# Altium project investigator_control_board.PrjPcb
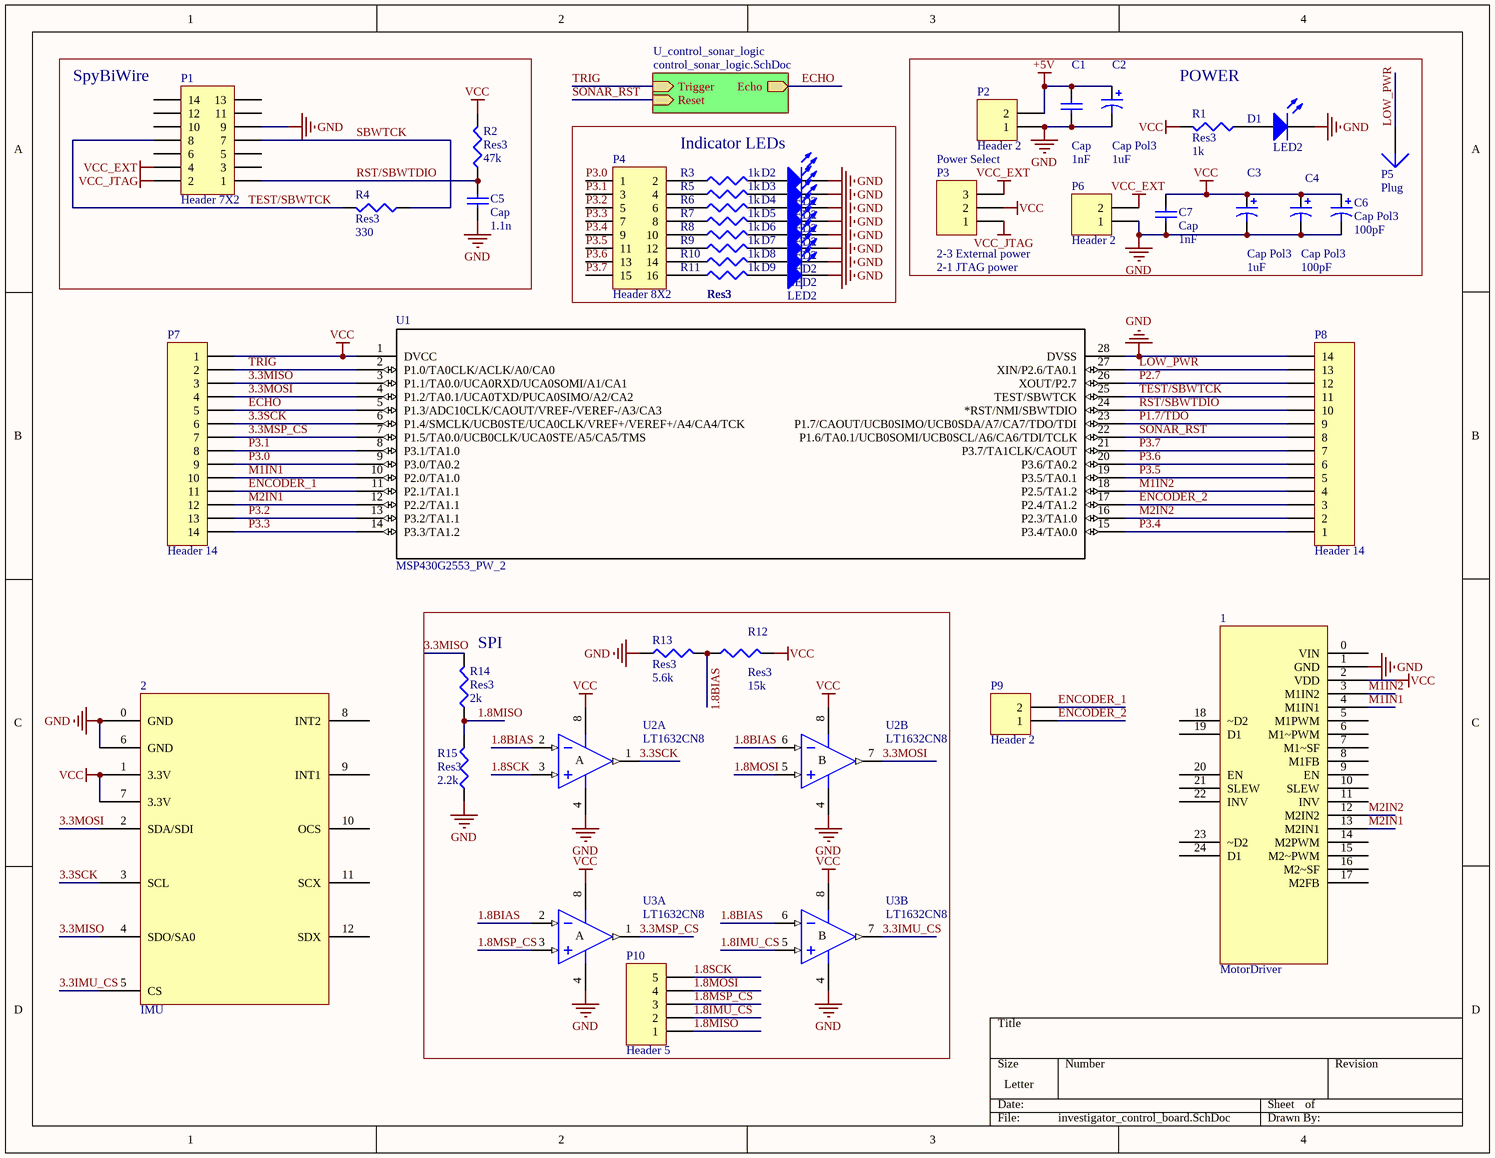
[diagram p0: investigator_control_board.SchDoc]
2 sheets, 54 parts. Net scope: hierarchical (ports join the sheet entries above them; power ports are global).
Board files: investigator_control_board.PcbDoc, control_board_v2.PcbDoc
Sheets:
  investigator_control_board.SchDoc
    U_control_sonar_logic = control_sonar_logic.SchDoc

## Sheet investigator_control_board.SchDoc
size Letter

### Parts
1  MotorDriver  [MotorControlHeader]
2  IMU  [IMU]
C1  Cap  value 1nF  [C0805]
C2  Cap Pol3  value 1uF  [AXIAL-0.3]
C3  Cap Pol3  value 1uF  [AXIAL-0.3]
C4  Cap Pol3  value 100pF  [AXIAL-0.3]
C5  Cap  value 1.1n  [C0805]
C6  Cap Pol3  value 100pF  [AXIAL-0.3]
C7  Cap  value 1nF  [C0805]
D1  LED2  [3.2X1.6X1.1]
D2  LED2  [3.2X1.6X1.1]
D3  LED2  [3.2X1.6X1.1]
D4  LED2  [3.2X1.6X1.1]
D5  LED2  [3.2X1.6X1.1]
D6  LED2  [3.2X1.6X1.1]
D7  LED2  [3.2X1.6X1.1]
D8  LED2  [3.2X1.6X1.1]
D9  LED2  [3.2X1.6X1.1]
P1  Header 7X2  [HDR2X7]
P2  Header 2  [HDR1X2]
P3  Power Select  [HDR1X3]
P4  Header 8X2  [HDR2X8]
P5  Plug  [PIN1]
P6  Header 2  [HDR1X2]
P7  Header 14  [HDR1X14]
P8  Header 14  [HDR1X14]
P9  Header 2  [HDR1X2]
P10  Header 5  [HDR1X5]
R1  Res3  value 1k  [6-0805_M]
R2  Res3  value 47k  [6-0805_M]
R3  Res3  value 1k  [6-0805_N]
R4  Res3  value 330  [6-0805_M]
R5  Res3  value 1k  [6-0805_N]
R6  Res3  value 1k  [6-0805_N]
R7  Res3  value 1k  [6-0805_N]
R8  Res3  value 1k  [6-0805_N]
R9  Res3  value 1k  [6-0805_N]
R10  Res3  value 1k  [6-0805_N]
R11  Res3  value 1k  [6-0805_N]
R12  Res3  value 15k  [6-0805_N]
R13  Res3  value 5.6k  [6-0805_N]
R14  Res3  value 2k  [6-0805_N]
R15  Res3  value 2.2k  [6-0805_N]
U1  MSP430G2553_PW_2  [PW28]
U2  LT1632CN8  [SO08]  (parts A,B of 2)
U3  LT1632CN8  [SO08]  (parts A,B of 2)

### Blocks framed on the sheet
SpyBiWire: C5 P1 R2 R4
POWER: C1-C4 C6 C7 D1 P2 P3 P5 P6 R1
Indicator LEDs: D2-D9 P4 R3 R5-R11
SPI: P10 R12-R15 U2 U3

### Sub-sheets
U_control_sonar_logic = control_sonar_logic.SchDoc: Trigger (in), Reset (in), Echo (out)

### Nets
+5V: C1.2 C2.1 P2.2
GND: 1.1(GND) 2.0(GND) 2.6(GND) C1.1 C2.2 C3.2 C4.2 C5.1 C6.2 C7.1 D1.2(K) D2.2(K) D3.2(K) D4.2(K) D5.2(K) D6.2(K) D7.2(K) D8.2(K) D9.2(K) P1.9 P2.1 P6.1 P8.14 R13.1 R15.1 U1.28(DVSS) U2.4(V-) U3.4(V-)
VCC: 1.2(VDD) 2.1(3.3V) 2.7(3.3V) C3.1 C4.1 C6.1 C7.2 P3.2 P7.1 R1.2 R2.2 R12.2 U1.1(DVCC) U2.8(V+) U3.8(V+)
VCC_EXT: P1.4 P3.3 P6.2
VCC_JTAG: P1.2 P3.1
1.8BIAS: R12.1 R13.2 U2.2(IN-) U2.6(IN-) U3.2(IN-) U3.6(IN-)
1.8IMU_CS: P10.2 U3.5(IN+)
1.8MISO: P10.1 R14.1 R15.2
1.8MOSI: P10.4 U2.5(IN+)
1.8MSP_CS: P10.3 U3.3(IN+)
1.8SCK: P10.5 U2.3(IN+)
3.3IMU_CS: 2.5(CS) U3.7(OUT)
3.3MISO: 2.4(SDO/SA0) P7.3 R14.2 U1.3(P1.1/TA0.0/UCA0RXD/UCA0SOMI/A1/CA1)
3.3MOSI: 2.2(SDA/SDI) P7.4 U1.4(P1.2/TA0.1/UCA0TXD/PUCA0SIMO/A2/CA2) U2.7(OUT)
3.3MSP_CS: P7.7 U1.7(P1.5/TA0.0/UCB0CLK/UCA0STE/A5/CA5/TMS) U3.1(OUT)
3.3SCK: 2.3(SCL) P7.6 U1.6(P1.4/SMCLK/UCB0STE/UCA0CLK/VREF+/VEREF+/A4/CA4/TCK) U2.1(OUT)
ECHO: P7.5 U1.5(P1.3/ADC10CLK/CAOUT/VREF-/VEREF-/A3/CA3) ; sheet U_control_sonar_logic/Echo
ENCODER_1: P7.11 P9.2 U1.11(P2.1/TA1.1)
ENCODER_2: P8.3 P9.1 U1.17(P2.4/TA1.2)
LOW_PWR: P5.1 P8.13 U1.27(XIN/P2.6/TA0.1)
M1IN1: 1.4(M1IN1) P7.10 U1.10(P2.0/TA1.0)
M1IN2: 1.3(M1IN2) P8.4 U1.18(P2.5/TA1.2)
M2IN1: 1.13(M2IN1) P7.12 U1.12(P2.2/TA1.1)
M2IN2: 1.12(M2IN2) P8.2 U1.16(P2.3/TA1.0)
P1.7/TDO: P8.9 U1.23(P1.7/CAOUT/UCB0SIMO/UCB0SDA/A7/CA7/TDO/TDI)
P2.7: P8.12 U1.26(XOUT/P2.7)
P3.0: P4.1 P7.9 U1.9(P3.0/TA0.2)
P3.1: P4.3 P7.8 U1.8(P3.1/TA1.0)
P3.2: P4.5 P7.13 U1.13(P3.2/TA1.1)
P3.3: P4.7 P7.14 U1.14(P3.3/TA1.2)
P3.4: P4.9 P8.1 U1.15(P3.4/TA0.0)
P3.5: P4.11 P8.5 U1.19(P3.5/TA0.1)
P3.6: P4.13 P8.6 U1.20(P3.6/TA0.2)
P3.7: P4.15 P8.7 U1.21(P3.7/TA1CLK/CAOUT)
RST/SBWTDIO: C5.2 P1.1 P8.10 R2.1 U1.24(*RST/NMI/SBWTDIO)
SBWTCK: P1.7 R4.1
SONAR_RST: P8.8 U1.22(P1.6/TA0.1/UCB0SOMI/UCB0SCL/A6/CA6/TDI/TCLK) ; sheet U_control_sonar_logic/Reset
TEST/SBWTCK: P1.8 P8.11 R4.2 U1.25(TEST/SBWTCK)
TRIG: P7.2 U1.2(P1.0/TA0CLK/ACLK/A0/CA0) ; sheet U_control_sonar_logic/Trigger
NetD1_1: D1.1(A) R1.1
NetD2_1: D2.1(A) R3.2
NetD3_1: D3.1(A) R5.2
NetD4_1: D4.1(A) R6.2
NetD5_1: D5.1(A) R7.2
NetD6_1: D6.1(A) R8.2
NetD7_1: D7.1(A) R9.2
NetD8_1: D8.1(A) R10.2
NetD9_1: D9.1(A) R11.2
NetP4_2: P4.2 R3.1
NetP4_4: P4.4 R5.1
NetP4_6: P4.6 R6.1
NetP4_8: P4.8 R7.1
NetP4_10: P4.10 R8.1
NetP4_12: P4.12 R9.1
NetP4_14: P4.14 R10.1
NetP4_16: P4.16 R11.1

Not connected (* = marked no-connect by the designer): 1 0(VIN) 5(M1PWM) 6(M1~PWM) 7(M1~SF) 8(M1FB) 9(EN) 10(SLEW) 11(INV) 14(M2PWM) 15(M2~PWM) 16(M2~SF) 17(M2FB) 18(~D2) 19(D1) 20(EN) 21(SLEW) 22(INV) 23(~D2) 24(D1); 2 8(INT2) 9(INT1) 10(OCS) 11(SCX) 12(SDX); P1 3 5 6 10 11 12 13 14

### Notes on the sheet
- (near P3) 2-3 External power
- (near P3) 2-1 JTAG power
- (in symbol LT1632CN8, part A) A
- (in symbol LT1632CN8, part B) B

### Library data of the parts
C1 C5 C7 = Cap: Capacitor; Published: 8-Jun-2000; LatestRevisionDate: 17-Jul-2002; LatestRevisionNote: Re-released for DXP Platform.; PackageReference: RAD-0.3; Publisher: Altium Limited; PackageDescription: Radial Cap, Thru-Hole; 2 Leads; 0.3 in Pin Spacing
C2-C4 C6 = Cap Pol3: Polarized Capacitor (Surface Mount); Published: 8-Jun-2000; LatestRevisionDate: 29-May-2009; LatestRevisionNote: IPC-7351 Footprint Added.; PackageReference: C0805; Publisher: Altium Limited; PackageDescription: Chip Capacitor
D1-D9 = LED2: Typical RED, GREEN, YELLOW, AMBER GaAs LED; Published: 8-Jun-2000; LatestRevisionDate: 17-Jul-2002; LatestRevisionNote: Re-released for DXP Platform.; PackageVersion: Feb-2002; PackageReference: 3.2X1.6X1.1; Publisher: Altium Limited; PackageDescription: SM LED; 2 Flat Leads
P1 = Header 7X2: Header, 7-Pin, Dual row; LatestRevisionDate: 17-Jul-2002; LatestRevisionNote: Re-released for DXP Platform.; Publisher: Altium Limited
P2 P6 P9 = Header 2: Header, 2-Pin; LatestRevisionDate: 17-Jul-2002; LatestRevisionNote: Re-released for DXP Platform.; Publisher: Altium Limited
P3 = Header 3: Header, 3-Pin; LatestRevisionDate: 17-Jul-2002; LatestRevisionNote: Re-released for DXP Platform.; Publisher: Altium Limited
P4 = Header 8X2: Header, 8-Pin, Dual row; LatestRevisionDate: 17-Jul-2002; LatestRevisionNote: Re-released for DXP Platform.; Publisher: Altium Limited
P7 P8 = Header 14: Header, 14-Pin; LatestRevisionDate: 17-Jul-2002; LatestRevisionNote: Re-released for DXP Platform.; Publisher: Altium Limited
P10 = Header 5: Header, 5-Pin; LatestRevisionDate: 17-Jul-2002; LatestRevisionNote: Re-released for DXP Platform.; Publisher: Altium Limited
R1-R15 = Res3: Resistor; Published: 8-Jun-2000; LatestRevisionDate: 29-May-2009; LatestRevisionNote: IPC-7351 Footprint Added.; PackageReference: J1-0603; Publisher: Altium Limited; PackageDescription: Chip Resistor
U1 = MSP430G2553_PW_2: Imported; Manufacturer_Part_Number: msp430g2553_pw_28; Vendor: Texas Instruments; PACKAGE_DESIGNATOR: PW; PIN_COUNT: 28; FAMILY_NAME: Value Line; INDUSTRY_STD_PKG_TYPE: TSSOP; GENERIC_PART_NUMBER: MSP430G2553; Datasheet URL: http://www.ti.com/lit/gpn/MSP430G2553; Manufacturer: Texas Instruments; RefDes: RefDes; Type: DEV; Value: Value
U2 U3 = LT1632CN8: 45MHz, 45V/µs, Dual Rail-to-Rail Input and Output Precision Operational Amplifier; Note: 1455; Published: 8-Jun-2000; LatestRevisionDate: 29-May-2009; LatestRevisionNote: Component Body Added.; DatasheetVersion: 1996; PackageVersion: N8 1002; PackageReference: N8; Publisher: Altium Limited; PackageDescription: DIP, Plastic, 8-Pin, Row Spacing 7.62 mm, Pitch 2.54 mm; ComponentLink1Description: Manufacturer Link; ComponentLink1URL: http://www.linear.com/; ComponentLink2Description: Datasheet; ComponentLink2URL: http://www.linear.com/pc/downloadDocument.do?navId=H0,C1,C1154,C1009,C1022,P1642,D3055
P5 = Plug: LatestRevisionDate: 17-Jul-2002; LatestRevisionNote: Re-released for DXP Platform.; Publisher: Altium Limited

## Sheet control_sonar_logic.SchDoc
size Letter
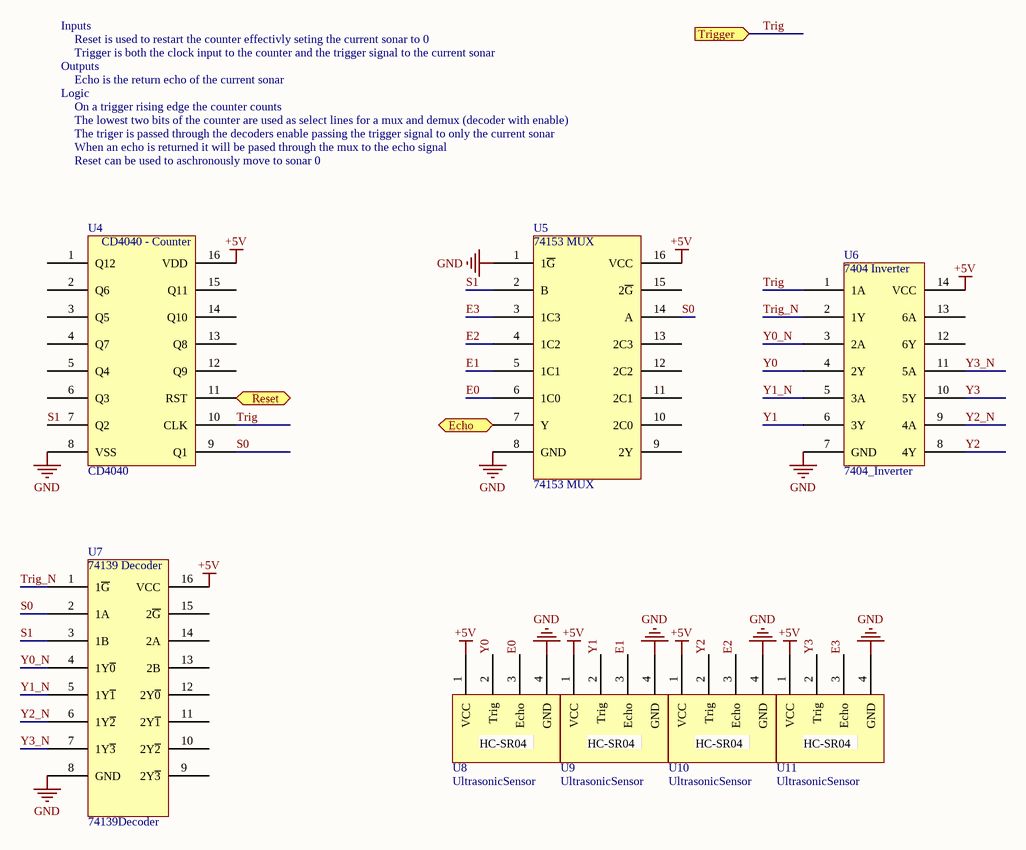
[diagram p1: control_sonar_logic.SchDoc]

### Parts
U4  CD4040  [DIP-16]
U5  74153 MUX  [DIP-16]
U6  7404_Inverter  [DIP-14]
U7  74139Decoder  [DIP-16]
U8  UltrasonicSensor  [HDR1X4]
U9  UltrasonicSensor  [HDR1X4]
U10  UltrasonicSensor  [HDR1X4]
U11  UltrasonicSensor  [HDR1X4]

### Ports
Echo (out), Reset (in), Trigger (in)

### Nets
+5V: U4.16(VDD) U5.16(VCC) U6.14(VCC) U7.16(VCC) U8.1(VCC) U9.1(VCC) U10.1(VCC) U11.1(VCC)
GND: U4.8(VSS) U5.1(1~{G}) U5.8(GND) U6.7(GND) U7.8(GND) U8.4(GND) U9.4(GND) U10.4(GND) U11.4(GND)
E0: U5.6(1C0) U8.3(Echo)
E1: U5.5(1C1) U9.3(Echo)
E2: U5.4(1C2) U10.3(Echo)
E3: U5.3(1C3) U11.3(Echo)
ECHO: U5.7(Y) ; port Echo
S0: U4.9(Q1) U5.14(A) U7.2(1A)
S1: U4.7(Q2) U5.2(B) U7.3(1B)
SONAR_RST: U4.11(RST) ; port Reset
TRIG: U4.10(CLK) U6.1(1A) ; port Trigger
Trig_N: U6.2(1Y) U7.1(1~{G})
Y0: U6.4(2Y) U8.2(Trig)
Y0_N: U6.3(2A) U7.4(1Y~{0})
Y1: U6.6(3Y) U9.2(Trig)
Y1_N: U6.5(3A) U7.5(1Y~{1})
Y2: U6.8(4Y) U10.2(Trig)
Y2_N: U6.9(4A) U7.6(1Y~{2})
Y3: U6.10(5Y) U11.2(Trig)
Y3_N: U6.11(5A) U7.7(1Y~{3})

Not connected (* = marked no-connect by the designer): U4 1(Q12) 2(Q6) 3(Q5) 4(Q7) 5(Q4) 6(Q3) 12(Q9) 13(Q8) 14(Q10) 15(Q11); U5 9(2Y) 10(2C0) 11(2C1) 12(2C2) 13(2C3) 15(2~{G}); U6 12(6Y) 13(6A); U7 9(2Y~{3}) 10(2Y~{2}) 11(2Y~{1}) 12(2Y~{0}) 13(2B) 14(2A) 15(2~{G})

### Notes on the sheet
- Inputs
- Trigger is both the clock input to the counter and the trigger signal to the current sonar
- Reset is used to restart the counter effectivly seting the current sonar to 0
- Outputs
- Logic
- Echo is the return echo of the current sonar
- On a trigger rising edge the counter counts
- The lowest two bits of the counter are used as select lines for a mux and demux (decoder with enable)
- The triger is passed through the decoders enable passing the trigger signal to only the current sonar
- When an echo is returned it will be pased through the mux to the echo signal
- Reset can be used to aschronously move to sonar 0
- (in symbol 7404_Inverter) 7404 Inverter
- (in symbol 74139Decoder) 74139 Decoder
- (in symbol CD4040) CD4040 - Counter
- (in symbol UltrasonicSensor) HC-SR04

## Nets that join several sheets
+5V: investigator_control_board (C1.2 C2.1 P2.2), control_sonar_logic (8 pins)
GND: investigator_control_board (28 pins), control_sonar_logic (9 pins)
ECHO: investigator_control_board (P7.5 U1.5), control_sonar_logic (U5.7)
SONAR_RST: investigator_control_board (P8.8 U1.22), control_sonar_logic (U4.11)
TRIG: investigator_control_board (P7.2 U1.2), control_sonar_logic (U4.10 U6.1)